# EAGLE design mailboxWiFi (EAGLE 9.6.2)
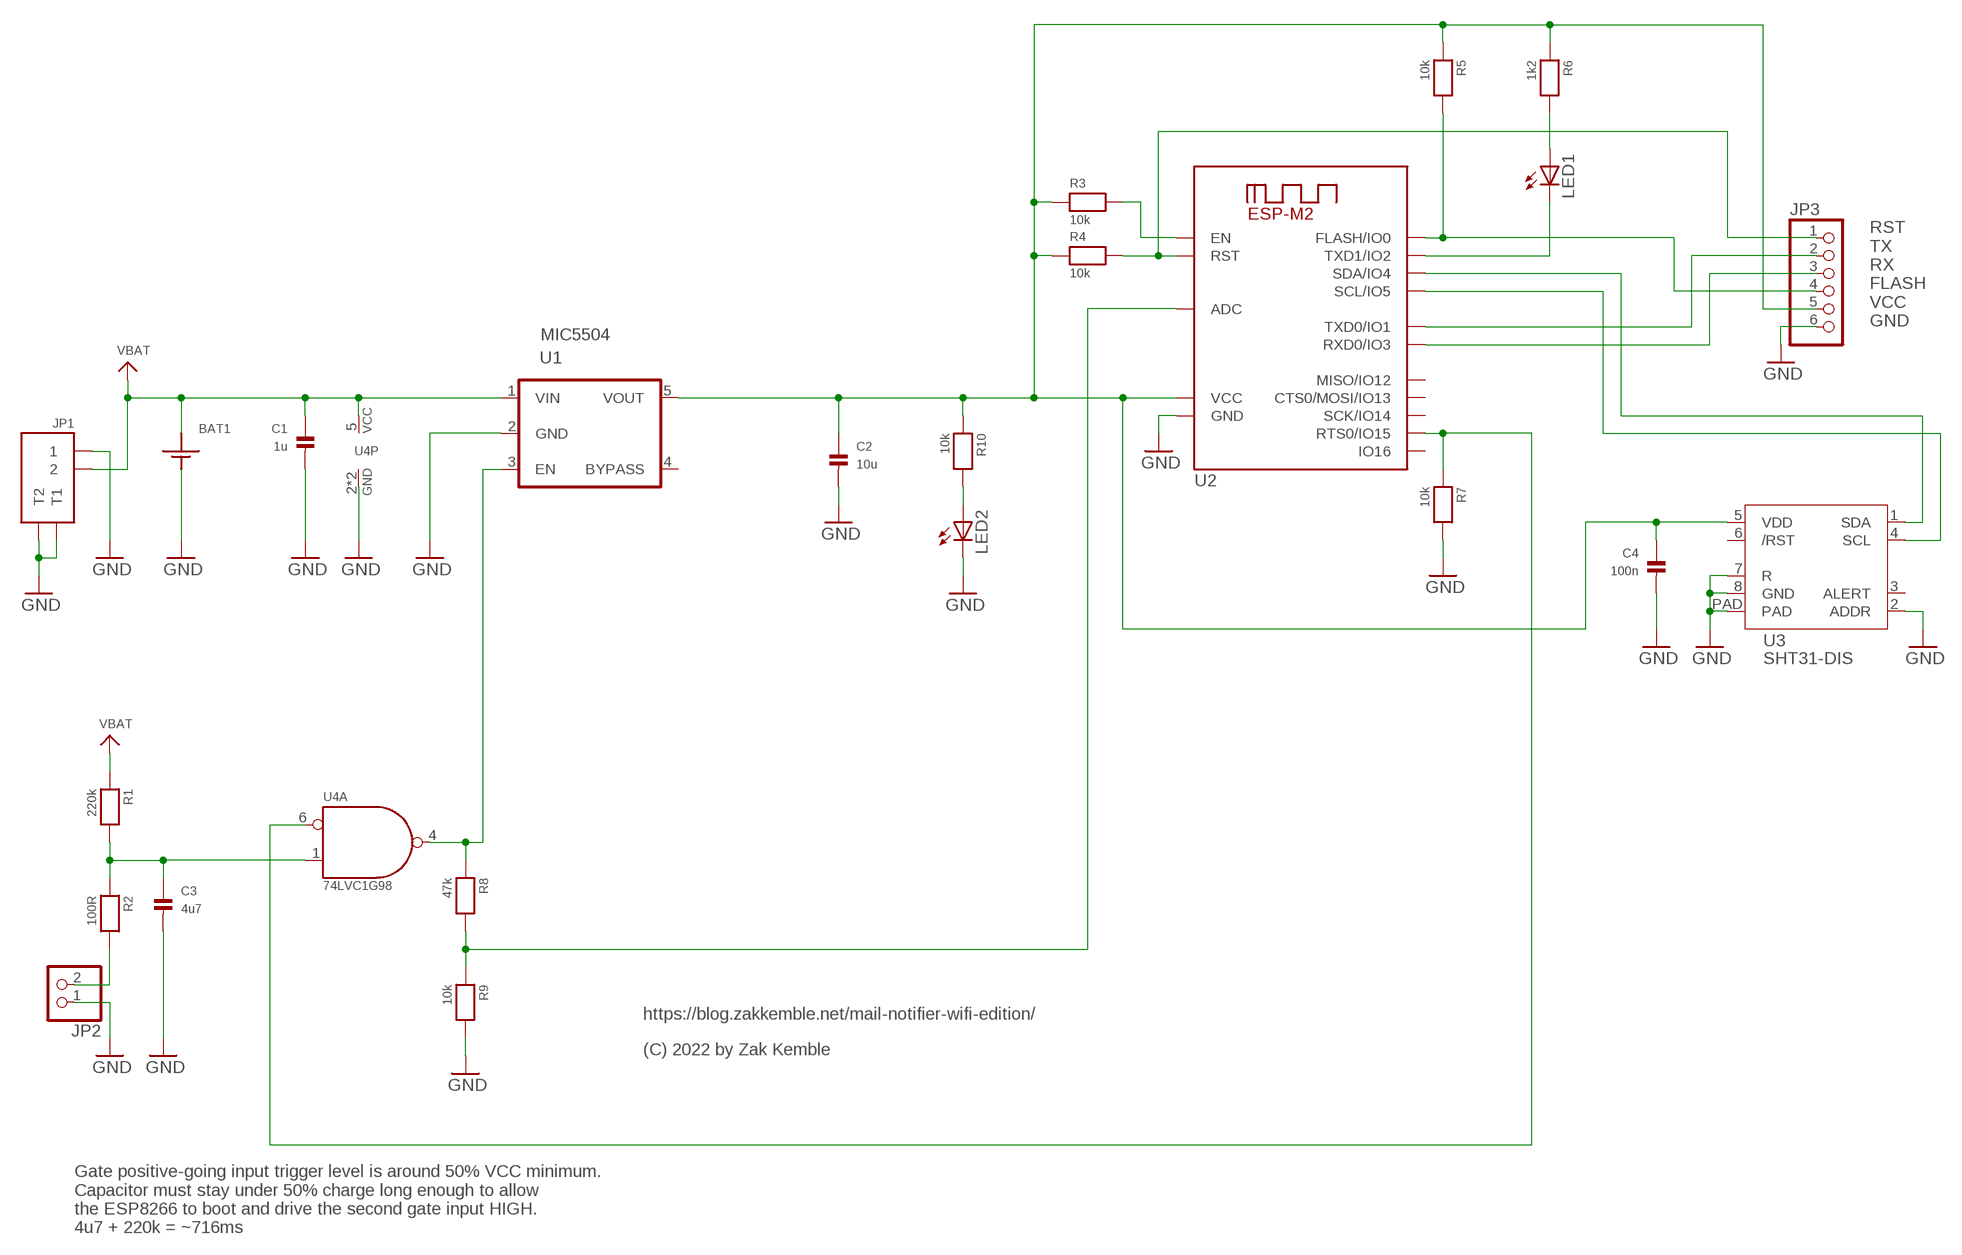
[diagram p0: schematic, sheet 1]

## Parts
BAT1  BATTERY_HOLDER1XAAA_PCB  [BATT_HOLDER_AAA_PCB]
C1  1u  CAP_CERAMIC0805  [0805_NO_OUTLINE]
C2  10u  CAP_CERAMIC1206  [1206]
C3  4u7  CAP_CERAMIC0805  [0805_NO_OUTLINE]
C4  100n  CAP_CERAMIC0402_XSMALL  [0402_XSMALL]
JP1  2WAY-SMDVERT  [2WAY-SMD]
JP2  PINHD-1X2/90  [1X02/90]
JP3  PINHD-1X6  [1X06]
LED1  LED0402_XSMALL  [0402_DIODE_XSMALL]
LED2  LED0402_XSMALL  [0402_DIODE_XSMALL]
R1  220k  RESISTOR0402_XSMALL  [0402_XSMALL]
R2  100R  RESISTOR0402_XSMALL  [0402_XSMALL]
R3  10k  RESISTOR0402_XSMALL  [0402_XSMALL]
R4  10k  RESISTOR0402_XSMALL  [0402_XSMALL]
R5  10k  RESISTOR0402_XSMALL  [0402_XSMALL]
R6  1k2  RESISTOR0402_XSMALL  [0402_XSMALL]
R7  10k  RESISTOR0402_XSMALL  [0402_XSMALL]
R8  47k  RESISTOR0402_XSMALL  [0402_XSMALL]
R9  10k  RESISTOR0402_XSMALL  [0402_XSMALL]
R10  10k  RESISTOR0402_XSMALL  [0402_XSMALL]
U1  MIC5504  REGULATOR_5SOT23-5  [SOT23-5_SM_PAD]
U2  ESP-M2  [ESP-M2]
U3  SHT31-DIS  SHT3X-DIS  [DFN_2.5X2.5_8]
U4  74LVC1G98  74LVC1G98-NAND_1INVSOT-363  [SOT-363]

## Nets
GND: BAT1.NEG C1.2 C2.2 C3.2 C4.2 JP1.1 JP1.TAB$1(T1) JP1.TAB$2(T2) JP2.1 JP3.6 LED2.2(C) R7.2 R9.2 U1.2(GND) U2.8(GND) U3.2(ADDR) U3.7(R) U3.8(GND) U3.PAD U4.2(P:GND) U4.3(P:GND)
N$1: R3.2 U2.2(EN)
N$5: U2.12(SCL/IO5) U3.4(SCL)
N$6: U2.11(SDA/IO4) U3.1(SDA)
N$9: JP3.1 R4.2 U2.15(RST)
N$11: C2.1 C4.1 JP3.5 R3.1 R4.1 R5.1 R6.1 R10.1 U1.5(VOUT) U2.7(VCC) U3.5(VDD)
N$12: R8.2 R9.1 U2.1(ADC)
N$15: C3.1 R1.2 R2.1 U4.1(A:B)
N$16: JP3.4 R5.2 U2.10(FLASH/IO0)
N$18: JP2.2 R2.2
N$19: R8.1 U1.3(EN) U4.4(A:Y)
N$20: R7.1 U2.6(RTS0/IO15) U4.6(A:A)
N$21: LED1.2(C) U2.9(TXD1/IO2)
N$22: LED2.1(A) R10.2
N$23: JP3.2 U2.14(TXD0/IO1)
N$24: JP3.3 U2.13(RXD0/IO3)
N$25: LED1.1(A) R6.2
VBAT: BAT1.POS C1.1 JP1.2 R1.1 U1.1(VIN) U4.5(P:VCC)
Unconnected: U1.4(BYPASS) U2.3(SCK/IO14) U2.4(MISO/IO12) U2.5(CTS0/MOSI/IO13) U2.16(IO16) U3.3(ALERT) U3.6(/RST)

## Notes on the sheet
- RST
  TX
  RX
  FLASH
  VCC
  GND
- https://blog.zakkemble.net/mail-notifier-wifi-edition/
- (C) 2022 by Zak Kemble
- Gate positive-going input trigger level is around 50% VCC minimum.
  Capacitor must stay under 50% charge long enough to allow
  the ESP8266 to boot and drive the second gate input HIGH.
  4u7 + 220k = ~716ms

## Library data of the parts
BAT1 = zak:BATTERY_HOLDER
C1 = zak:CAP_CERAMIC; FARNELL: 2470435
C2 = zak:CAP_CERAMIC; FARNELL: 9227881,1828814; FARNELL_ALT: 1288204,1463362,2611941
C3 = zak:CAP_CERAMIC; RS: 766-1037
C4 = zak:CAP_CERAMIC
JP1 = zak-molex-picoblade:2WAY-SMD
JP2 = pinhead:PINHD-1X2: PIN HEADER
JP3 = zak-headers:PINHD-1X6
LED1 LED2 = zak:LED
R1-R10 = zak:RESISTOR
U1 = zak:REGULATOR_5
U2 = zak:ESP-M2
U3 = zak:SHT3X-DIS
U4 = zak:74LVC1G98-NAND_1INV

## Board
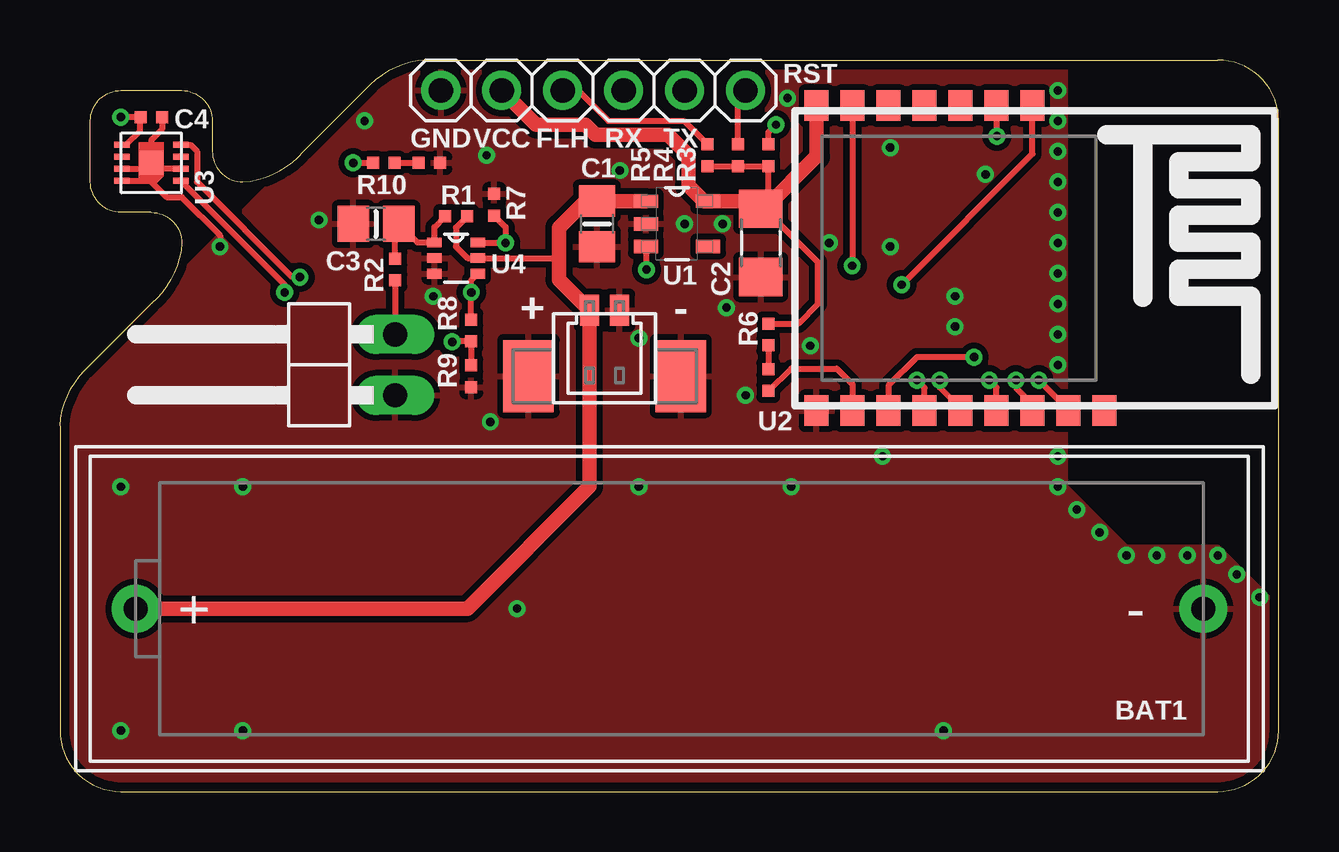
[diagram p1: board, top side]
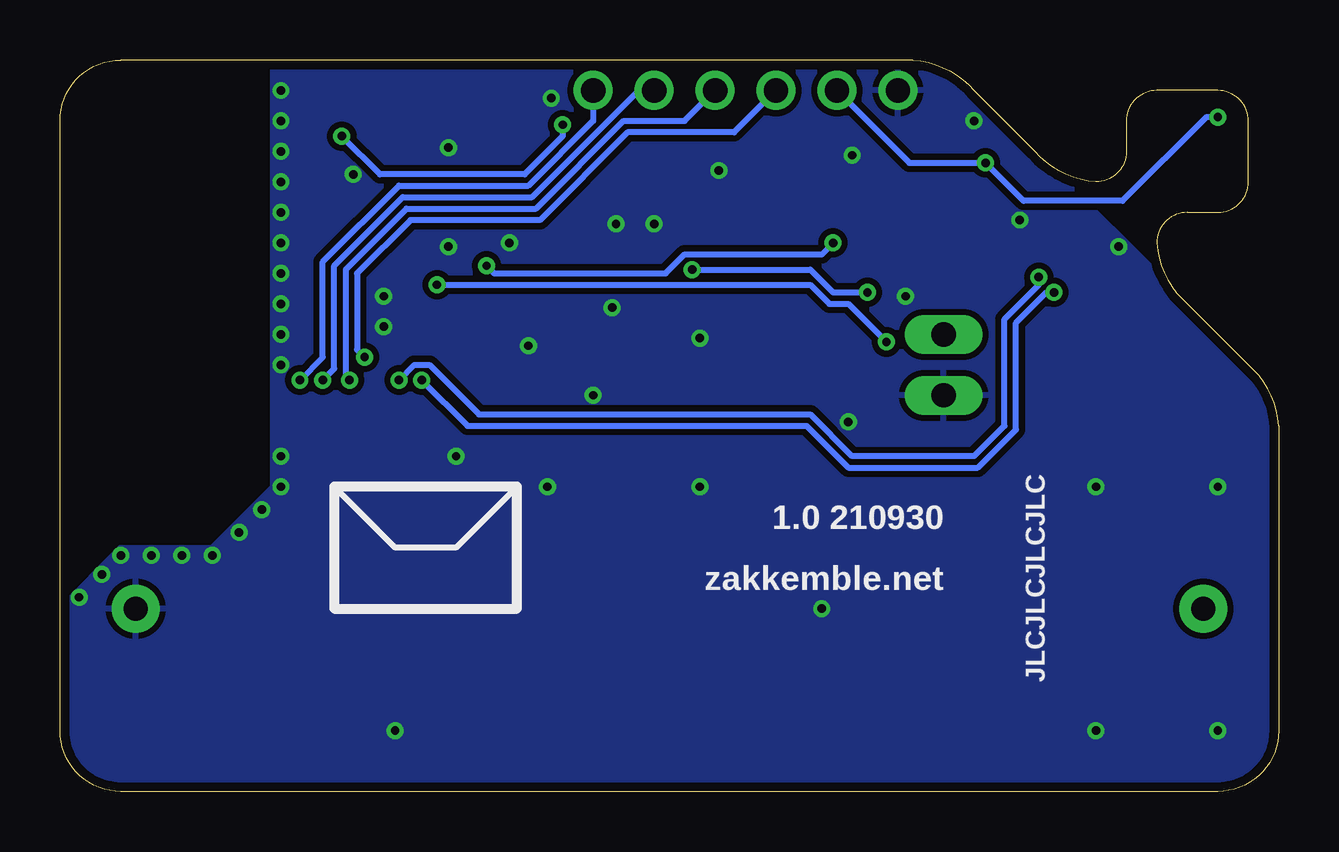
[diagram p2: board, bottom side, seen from below]

Size 50.8 x 30.48 mm. Coordinates in mm from the lower left corner, seen from the top.
Outline: 0,2.54 arc90 2.54,0 48.26,0 arc90 50.8,2.54 50.8,27.94 arc90 48.26,30.48 15.24,30.48 arc45 12.7,29.21 10.16,26.67 arc-45 7.62,25.4 arc-90 6.35,26.67 6.35,27.94 arc90 5.08,29.21 2.54,29.21 arc90 1.27,27.94 1.27,25.4 arc90 2.54,24.13 3.81,24.13 arc-90 5.08,22.86 arc-45 3.81,20.32 1.27,17.78 arc45 0,15.24 0,2.54
Copper layers (1*16): Top 0.0356mm / dielectric 1.5011mm / Bottom 0.0356mm
Design rules "LaenPCBOrder *": minimum track width 6mil, minimum drill 13mil, track to track 6mil, track to pad 6mil, pad to pad 6mil, via to via 6mil, smd to smd 6mil, copper to edge 15mil, drill to drill 6mil, minimum pad ring 12mil, minimum via ring 7mil, stop-mask expansion 4mil, vias tented up to drill 24mil, thermal gap 10mil
Milling: 22 lines

### Footprints (pad centres in the part's own frame; a part is rotated, then mirrored left to right if it is on the bottom)
BATT_HOLDER_AAA_PCB = drill 1 pad 2: NEG -22.25,0; POS 22.25,0
0805_NO_OUTLINE = smd 1.3 x 1.5: 1 -0.95,0; 2 0.95,0
1206 = smd 1.6 x 1.803: 1 -1.422,0; 2 1.422,0
0402_XSMALL = smd 0.5 x 0.5: 1 -0.45,0; 2 0.45,0
2WAY-SMD = smd 0.8 x 1.3: 1 0.625,2.75; 2 -0.625,2.75 | smd 2.1 x 3: TAB$1 3.175,0; TAB$2 -3.175,0
1X02/90 = drill 1.016 long: 1 -1.27,-3.81; 2 1.27,-3.81
1X06 = drill 1.016: 1 -6.35,0; 2 -3.81,0; 3 -1.27,0; 4 1.27,0; 5 3.81,0; 6 6.35,0
0402_DIODE_XSMALL = smd 0.5 x 0.5: 1 -0.45,0; 2 0.45,0
SOT23-5_SM_PAD = smd 1 x 0.56: 1 -1.295,0.94; 2 -1.295,0; 3 -1.295,-0.94; 4 1.295,-0.94; 5 1.295,0.94
ESP-M2 = smd 1.27 x 1: 1 -6.35,-0.1; 2 -6.35,-1.6; 3 -6.35,-3.1; 4 -6.35,-4.6; 5 -6.35,-6.1; 6 -6.35,-7.6; 7 -6.35,-9.1; 8 6.35,-9.1; 9 6.35,-7.6; 10 6.35,-6.1; 11 6.35,-4.6; 12 6.35,-3.1; 13 6.35,-1.6; 14 6.35,-0.1; 15 6.35,1.4; 16 6.35,2.9
DFN_2.5X2.5_8 = smd 0.65 x 0.25: 1 -1.225,0.75; 2 -1.225,0.25; 3 -1.225,-0.25; 4 -1.225,-0.75; 5 1.225,-0.75; 6 1.225,-0.25; 7 1.225,0.25; 8 1.225,0.75 | smd 1 x 1: PAD 0,0
SOT-363 = smd 0.6 x 0.4: 1 -0.9,0.65; 2 -0.9,0; 3 -0.9,-0.65; 4 0.9,-0.65; 5 0.9,0; 6 0.9,0.65

### Placement (x,y rotation side)
BAT1  25.4,7.62 180 top
C1  22.38,23.65 270 top
C2  29.21,22.86 270 top
C3  13.18,23.65 180 top
C4  3.81,28.1 0 top
JP1  22.7,17.3 0 top
JP2  10.16,17.78 90 top
JP3  22.22,29.21 180 top
LED1  29.53,17.15 270 top
LED2  15.4,26.19 0 top
R1  16.51,23.97 180 top
R2  13.97,21.75 270 top
R3  29.53,26.51 90 top
R4  28.26,26.51 90 top
R5  26.99,26.51 90 top
R6  29.53,19.05 270 top
R7  18.1,24.45 90 top
R8  17.14,19.21 270 top
R9  17.14,17.3 270 top
R10  13.49,26.19 0 top
U1  25.72,23.65 0 top
U2  40.64,22.23 270 top
U3  3.81,26.19 180 top
U4  16.51,22.23 0 top

### Tracks (layer width: path | path; a pad name or v marks a point on that pad's centre or on a via)
GND  (via drill 0.35)
  Top 0.254: U3.7 3.4,25.94 | 3.48,25.86 U3.PAD | U3.8 3.77,25.44 3.81,25.4 | 3.81,25.4 3.81,25.53 | 3.81,25.53 3.48,25.86 | 3.48,25.86 3.4,25.94 | U3.2 3.4,25.94 | C4.2 4.26,27.6 3.81,27.15 U3.PAD | U3.PAD 3.81,25.53 | 3.81,25.4 4.45,24.77 5.08,24.77 6.67,23.18 v6.67,22.7
  other vias: 41.59,25.4 41.59,27.94 41.59,17.78 41.59,19.05 41.59,20.32 41.59,21.59 41.59,22.86 41.59,24.13 41.59,26.67 34.61,22.7 37.31,19.37 32.07,22.86 34.61,26.83 38.58,25.72 31.27,18.57 28.58,16.51 27.78,20.16 26.03,23.65 23.34,25.88 30.32,28.89 41.59,29.21 41.59,13.97 41.59,12.7 42.39,11.75 43.34,10.8 44.45,9.84 45.72,9.84 46.99,9.84 48.26,9.84 49.05,9.05 50.01,8.1 2.54,2.54 7.62,2.54 2.54,12.7 7.62,12.7 19.05,7.62 30.48,12.7 36.83,2.54 10.79,23.81 17.78,26.51 12.7,27.94 24.13,18.89 17.94,15.4 27.62,23.65 15.56,20.64 37.31,20.64 24.13,12.7 34.29,13.97
  pour Top (isolate 0.254, rank 6): 41.91,30.48 13.97,30.48 0,16.51 0,0 50.8,0 50.8,7.62 48.26,10.16 44.45,10.16 41.91,12.7
  pour Bottom (isolate 0.254, rank 6): 41.91,30.48 13.97,30.48 0,16.51 0,0 50.8,0 50.8,7.62 48.26,10.16 44.45,10.16 41.91,12.7
N$1  (via drill 0.35)
  Top 0.254: R3.2 29.53,27.46 v29.84,27.78 | v39.05,27.31 39.05,28.56 U2.2
  Bottom 0.254: v29.84,27.78 29.84,27.31 31.43,25.72 37.46,25.72 v39.05,27.31
N$5  (via drill 0.35)
  Top 0.254: U3.4 5.44,26.94 5.71,26.67 5.71,25.4 9.68,21.43 v10,21.43 | U2.12 37.54,15.96 36.67,16.83 v36.67,17.15
  Bottom 0.254: v36.67,17.15 36.04,17.78 35.4,17.78 33.34,15.72 19.53,15.72 17.78,13.97 12.7,13.97 11.43,15.24 11.43,19.69 10,21.11 v10,21.43
N$6  (via drill 0.35)
  Top 0.254: U3.1 9.37,21.11 v9.37,20.8 | U2.11 36.04,16.82 v35.72,17.15
  Bottom 0.254: v35.72,17.15 33.81,15.24 19.68,15.24 17.94,13.49 12.54,13.49 10.95,15.08 10.95,19.53 9.68,20.8 v9.37,20.8
N$9  (via drill 0.35)
  Top 0.254: R4.2 28.26,28.89 JP3.1 | U2.15 42.04,15.9 v40.8,17.15
  Bottom 0.254: JP3.1 28.58,27.94 31.27,25.24 36.67,25.24 39.85,22.07 39.85,18.1 v40.8,17.15
N$11  (via drill 0.35)
  Top 0.254: R5.1 R4.1 R3.1 29.53,24.6 C2.1 | C4.1 3.33,28.1 | 3.33,28.1 v2.54,28.1 | U3.5 2.74,26.94 3.33,27.53 3.33,28.1 | v12.22,26.19 R10.1 | R6.1 30.77,19.5 31.59,20.32 31.59,22.05 29.36,24.28
  Top 0.61: U2.7 31.54,26.46 29.36,24.28 C2.1 28.9,24.59 U1.5 26.84,24.59 26.19,25.24 26.19,26.51 25.35,27.36 22.33,27.36 21.91,27.78 19.84,27.78 JP3.5
  Bottom 0.254: v2.54,28.1 3.02,28.1 6.51,24.61 10.64,24.61 v12.22,26.19 15.4,26.19 JP3.5
N$12  (via drill 0.35)
  Top 0.254: R9.1 R8.2 16.38,18.76 v16.35,18.73 | U2.1 40.54,26.57 v35.08,21.11
  Bottom 0.254: v16.35,18.73 17.94,20.32 18.73,20.32 19.53,21.11 v35.08,21.11
N$15
  Top 0.254: R1.2 15.61,23.52 U4.1 14.91,22.88 C3.1 13.97,23.5 R2.1
N$16  (via drill 0.35)
  Top 0.254: JP3.4 21.59,29.21 22.86,27.94 26.01,27.94 R5.2 | v38.1,18.1 35.72,18.1 34.54,16.92 U2.10
  Bottom 0.254: JP3.4 22.7,27.46 27.15,27.46 30.8,23.81 36.2,23.81 38.42,21.59 38.42,18.42 v38.1,18.1
N$18
  Top 0.254: R2.2 JP2.2
N$19  (via drill 0.35)
  Top 0.254: R8.1 v17.14,20.8 17.14,21.31 U4.4 | U1.3 24.42,21.77 v24.45,21.75
  Bottom 0.254: v24.45,21.75 19.53,21.75 18.57,20.8 v17.14,20.8
N$20  (via drill 0.35)
  Top 0.254: U2.6 33.04,21.91 v33.02,21.91 | U4.6 18.56,22.88 v18.57,22.86 18.57,23.52 R7.1
  Bottom 0.254: v33.02,21.91 32.7,21.59 25.56,21.59 24.77,22.38 19.05,22.38 v18.57,22.86
N$21
  Top 0.254: LED1.2 29.55,16.7 30.48,17.62 32.38,17.62 33.04,16.97 U2.9
N$22
  Top 0.254: R10.2 LED2.1
N$23  (via drill 0.35)
  Top 0.254: U2.14 40.54,16.13 39.85,16.83 v39.85,17.15
  Bottom 0.254: JP3.2 26.67,29.21 31.12,24.77 36.51,24.77 39.37,21.91 39.37,17.62 v39.85,17.15
N$24  (via drill 0.35)
  Top 0.254: U2.13 39.04,16.84 v38.73,17.15
  Bottom 0.254: JP3.3 24.77,27.94 27.3,27.94 30.96,24.29 36.35,24.29 38.89,21.75 38.89,17.3 v38.73,17.15
N$25
  Top 0.254: R6.2 LED1.1
VBAT
  Top 0.254: R1.1 16.96,23.95 16.51,23.5 16.51,22.7 16.99,22.23 U4.5 20.8,22.23 20.8,22.86
  Top 0.61: U1.1 22.39,24.59 C1.1 21.91,24.6 20.8,23.49 20.8,22.86 20.8,21.33 JP1.2 22.08,12.71 16.99,7.62 BAT1.POS

### Text on the board
tPlace: RST | GND | VCC | FLH | RX | TX | + | -
bPlace: 1.0 210930 | JLCJLCJLCJLC | zakkemble.net
bStop: Mail Notifier (WiFi)